# EAGLE design A4a ESP12 (EAGLE 9.6.2)
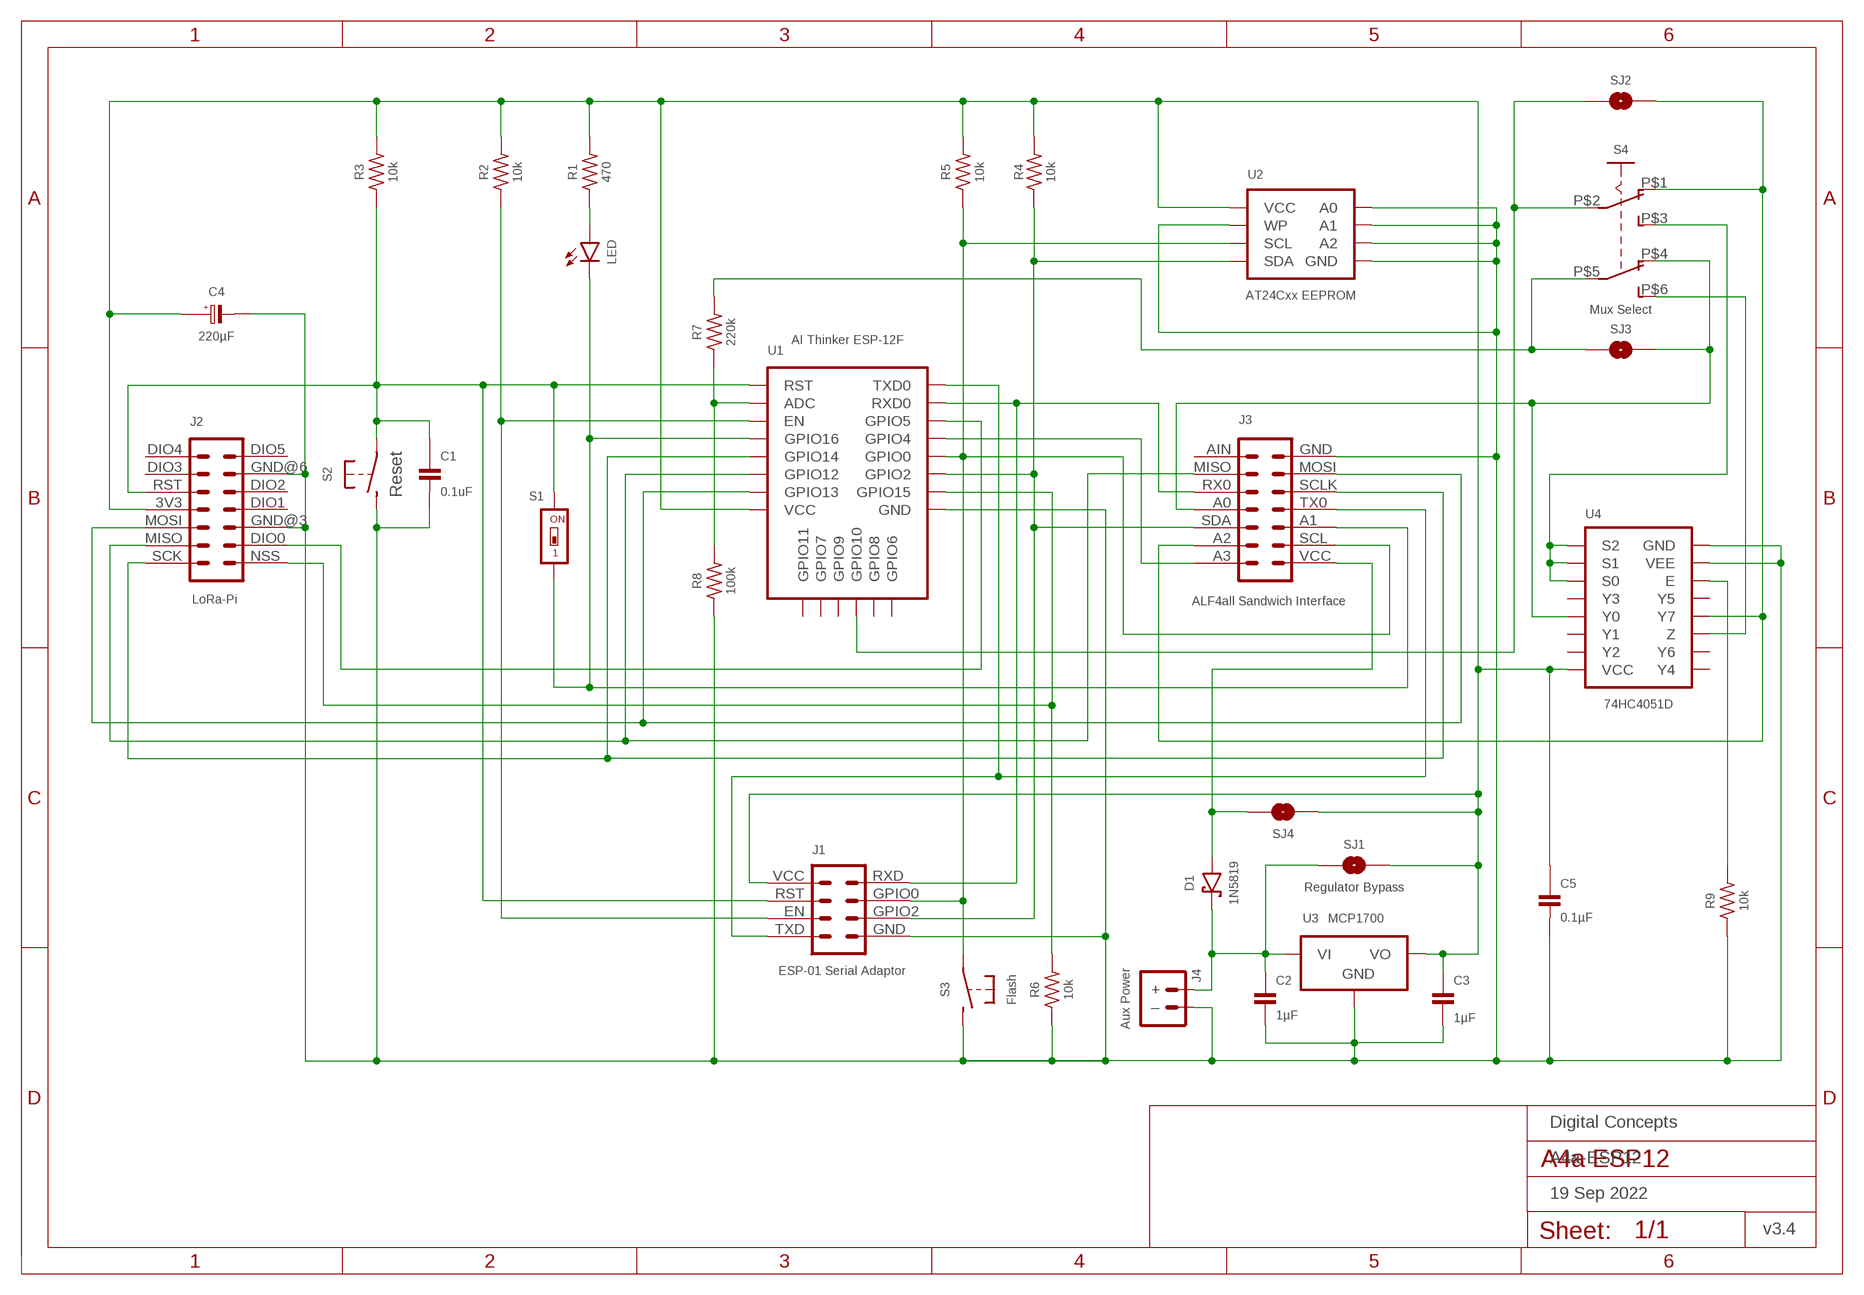
[diagram p0: schematic, sheet 1]
FRAME1 (A4L-LOC): DATE: 19 Sep 2022; OWNER: Digital Concepts; TITLE: A4a-ESP12; VERSION: v3.4

## Parts
C1  0.1uF  CAPACITOR-0805  [C0805]
C2  1µF  CAPACITOR  [C0805@1]
C3  1µF  CAPACITOR  [C0805@1]
C4  220µF  CAPACITOR-TANTALUM-3528  [C3528-21]
C5  0.1µF  CAPACITOR-0805  [C0805]
D1  1N5819  DIODE-SCHOTTKY-1N5819  [SOD-123]
J1  ESP-01 Serial Adaptor  ESP-01-SERIAL-ADAPTOR  [CONN_2X4-ESP-01-SERIAL]
J2  LoRa-Pi  RFM95W-PI-HEADER  [RFM95W-PI]
J3  ALF4all Sandwich Interface  HEADER-2X7-ALF4ALL-PROCESSOR-B  [CONN_2X7-ALF4ALL-PROCESSOR-B]
J4  Aux Power  JST-PH2.0-2-MALE-HORIZONTALJST-PTH-2  [JST-PH2.0-2-HORIZONTAL]
LED  LEDCHIP-LED0805  [CHIP-LED0805]
R1  470  RESISTORR0805  [R0805]
R2  10k  RESISTORR0805  [R0805]
R3  10k  RESISTORR0805  [R0805]
R4  10k  RESISTORR0805  [R0805]
R5  10k  RESISTORR0805  [R0805]
R6  10k  RESISTORR0805  [R0805]
R7  220k  RESISTORR0805  [R0805]
R8  100k  RESISTORR0805  [R0805]
R9  10k  RESISTORR0805  [R0805]
S1  Wake  SWITCH-DIP-SWS001  [SMD-001]
S2  Reset  SWITCH-MOMENTARY-2-PIN  [SWITCH-2-PAD]
S3  Flash  SWITCH-MOMENTARY-2-PIN  [SWITCH-2-PAD]
S4  Mux Select  SWITCH-SLIDE-DPDT  [SWITCH-DPDT-SMD]
SJ1  Regulator Bypass  SJ  [SJ]
SJ2  SJ  [SJ]
SJ3  SJ  [SJ]
SJ4  SJ  [SJ]
U1  AI Thinker ESP-12F  ESP-12E/F  [ESP-12E/F]
U2  AT24Cxx EEPROM  AT24CXX-EEPROM  [SOP-8]
U3  MCP1700  [SOT-23-3]
U4  74HC4051D  [SOP16]

## Nets
GND: C1.2 C2.2 C3.2 C4.2(-) C5.2 J1.GND J2.GND@3 J2.GND@6 J3.GND J4.-(–) R6.1 R8.1 R9.1 S2.P$2(S) S3.P$2(S) U1.GND U2.P$1(A0) U2.P$2(A1) U2.P$3(A2) U2.P$4(GND) U2.P$7(WP) U3.1(GND) U4.7(VEE) U4.8(GND)
N$1: S4.P$2(P1) SJ2.1 U1.GPIO10
N$2: J2.NSS R6.2 U1.GPIO15
N$3: J2.SCK J3.SCLK U1.GPIO14
N$4: C1.1 J1.RST J2.RST R3.1 S1.2 S2.P$1(P) U1.RST
N$5: J2.MISO J3.MISO U1.GPIO12
N$6: J2.MOSI J3.MOSI U1.GPIO13
N$7: R7.1 R8.2 U1.ADC
N$8: J1.EN R2.1 U1.EN
N$9: D1.A J3.VCC SJ4.1
N$10: J1.TXD J3.TX0 U1.TXD0
N$11: J1.GPIO2 J3.SDA R4.1 U1.GPIO2 U2.P$5(SDA)
N$12: J3.A3 U1.GPIO4
N$13: J1.GPIO0 J3.SCL R5.1 S3.P$1(P) U1.GPIO0 U2.P$6(SCL)
N$14: LED.A R1.1
N$15: J3.A1 LED.C S1.1 U1.GPIO16
N$16: J1.RXD J3.RX0 U1.RXD0
N$17: R9.2 U4.6(E)
N$19: J2.DIO0 U1.GPIO5
N$20: J3.A2 S4.P$1(O1) SJ2.2 U4.4(Y7)
N$21: J3.A0 S4.P$4(O2) SJ3.2 U4.13(Y0)
N$22: S4.P$6(S2) U4.3(Z)
N$23: S4.P$3(S1) U4.9(S2) U4.10(S1) U4.11(S0)
N$25: R7.2 S4.P$5(P2) SJ3.1
N$26: C2.1 D1.C J4.+ SJ1.1 U3.3(VI)
VCC: C3.1 C4.1(+) C5.1 J1.VCC J2.3V3 R1.2 R2.2 R3.2 R4.2 R5.2 SJ1.2 SJ4.2 U1.VCC U2.P$8(VCC) U3.2(VO) U4.16(VCC)
Unconnected: J2.DIO1 J2.DIO2 J2.DIO3 J2.DIO4 J2.DIO5 J3.AIN U1.CS0(GPIO11) U1.GPIO9 U1.MISO(GPIO7) U1.MOSI(GPIO8) U1.SCLK(GPIO6) U4.1(Y4) U4.2(Y6) U4.5(Y5) U4.12(Y3) U4.14(Y1) U4.15(Y2)

## Library data of the parts
C1 C5 = digitalconcepts:CAPACITOR-0805: 0805 Capacitor
C2 C3 = digitalconcepts:CAPACITOR: 0805 Capacitor
C4 = digitalconcepts:CAPACITOR-TANTALUM-3528: Capacitor Polarised EIA 3528-21 (KEMET B)
D1 = digitalconcepts:DIODE-SCHOTTKY-1N5819: 1N5819 Schottky Diode SOD-123
J1 = digitalconcepts:ESP-01-SERIAL-ADAPTOR: ESP-01 Serial Adpator
J2 = digitalconcepts:RFM95W-PI-HEADER: RFM95W LoRa Wireless Transceiver Raspberry Pi Daughter Board
J3 = digitalconcepts:HEADER-2X7-ALF4ALL-PROCESSOR-B: ALF4all 'Sandwich' Processor (Bottom) 2x7 Pin Header Header soldered to underside of PCB
J4 = digitalconcepts:JST-PH2.0-2-MALE-HORIZONTAL: PH2.0 2P Right Angle PCB Connector; PROD_ID: CONN-09863; SKU: PRT-09914
LED = digitalconcepts:LED: LED OSRAM: - CHIPLED LG R971, LG N971, LY N971, LG Q971, LY Q971, LO R971, LY R971 LH N974, LH R974 LS Q976, LO Q976, LY Q976 LO Q996 - Hyper CHIPLED LW Q18S LB Q993, LB Q99A, LB R99A - SideLED LS A670, LO A670, LY A670, LG A670, LP A670 LB A673, LV A673, LT A673, LW A673 LH A674 LY A675 LS A676, LA A676, LO A676, LY A676, LW A676 LS A679, LY A679, LG A679 - Hyper Micro SIDELED® LS Y876, LA Y876, LO Y876, LY Y876 LT Y87S - SmartLED LW L88C, LW L88S LB L89C, LB L89S, LG L890 LS L89K, LO L89K, LY L89K LS L896, LA L896, LO L896, LY L896 - TOPLED LS T670, LO T670, LY T670, LG T670, LP T670 LSG T670, LSP T670, LSY T670, LOP T670, LYG T670 LG T671, LOG T671, LSG T671 LB T673, LV T673, LT T673, LW T673 LH T674 LS T676, LA T676, LO T676, LY T676, LB T676, LH T676, LSB T676, LW T676 LB T67C, LV T67C, LT T67C, LS T67K, LO T67K, LY T67K, LW E67C LS E67B, LA E67B, LO E67B, LY E67B, LB E67C, LV E67C, LT E67C LW T67C LS T679, LY T679, LG T679 LS T770, LO T770, LY T770, LG T770, LP T770 LB T773, LV T773, LT T773, LW T773 LH T774 LS E675, LA E675, LY E675, LS T675 LS T776, LA T776, LO T776, LY T776, LB T776 LHGB T686 LT T68C, LB T68C - Hyper Mini TOPLED® LB M676 - Mini TOPLED Santana® LG M470 LS M47K, LO M47K, LY M47K Source: http://www.osram.convergy.de LUXEON: - LUMILED® LXK2-PW12-R00, LXK2-PW12-S00, LXK2-PW14-U00, LXK2-PW14-V00 LXK2-PM12-R00, LXK2-PM12-S00, LXK2-PM14-U00 LXK2-PE12-Q00, LXK2-PE12-R00, LXK2-PE12-S00, LXK2-PE14-T00, LXK2-PE14-U00 LXK2-PB12-K00, LXK2-PB12-L00, LXK2-PB12-M00, LXK2-PB14-N00, LXK2-PB14-P00, LXK2-PB14-Q00 LXK2-PR12-L00, LXK2-PR12-M00, LXK2-PR14-Q00, LXK2-PR14-R00 LXK2-PD12-Q00, LXK2-PD12-R00, LXK2-PD12-S00 LXK2-PH12-R00, LXK2-PH12-S00 LXK2-PL12-P00, LXK2-PL12-Q00, LXK2-PL12-R00 Source: www.luxeon.com KINGBRIGHT: KA-3528ASYC Source: www.kingbright.com
R1-R9 = digitalconcepts:RESISTOR: Resistor; SPICEPREFIX: R
S1 = digitalconcepts:SWITCH-DIP-SWS001: SMD Dip Switch 1 pol.
S2 S3 = digitalconcepts:SWITCH-MOMENTARY-2-PIN: 2 Pin Momentary Switch
S4 = digitalconcepts:SWITCH-SLIDE-DPDT: Switch SMD DPDT
SJ1-SJ4 = digitalconcepts:SJ: Solder Jumper
U1 = digitalconcepts:ESP-12E/F: AI Thinker ESP-12E/F MCU
U2 = digitalconcepts:AT24CXX-EEPROM: AT24Cxx EEPROM SOP-8
U3 = digitalconcepts:MCP1700: MCP1700 Low Quiescent Current LDO Voltage Regulator
U4 = digitalconcepts:74HC4051D: 74HC4051 8-Port Multiplexer SOP-16

## Board
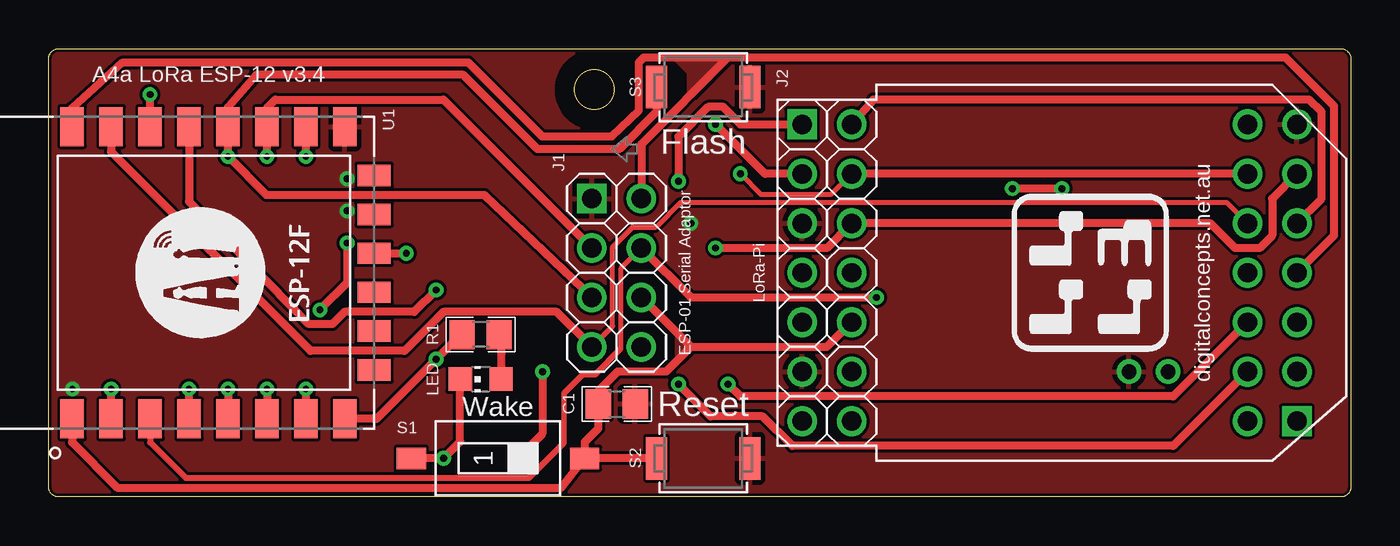
[diagram p1: board, top side]
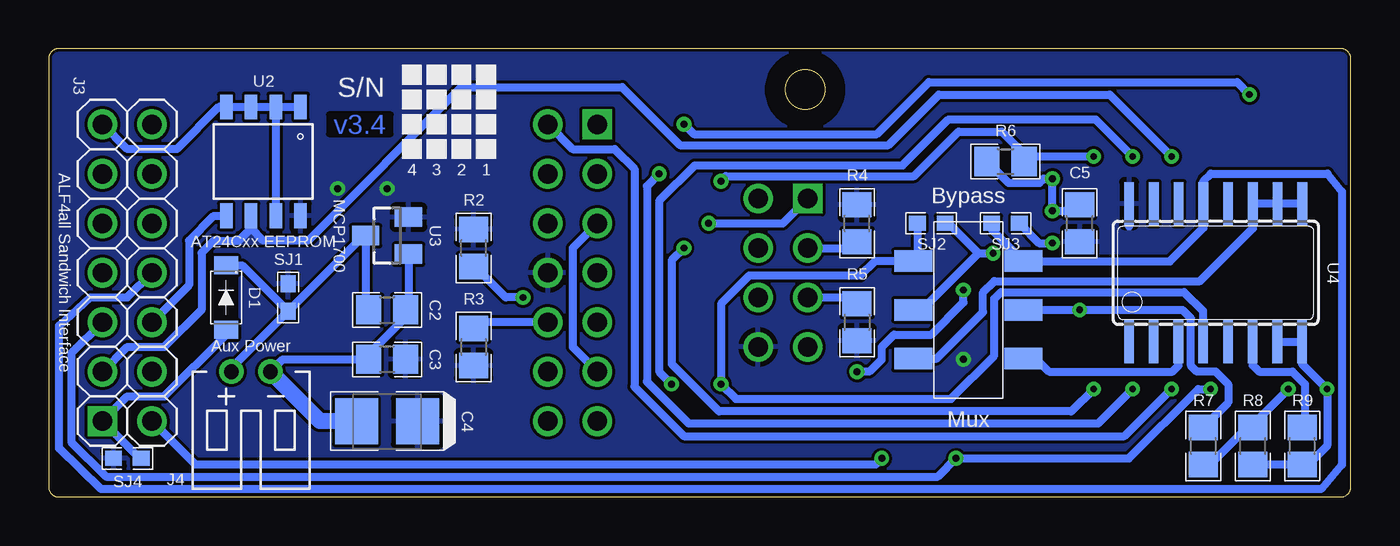
[diagram p2: board, bottom side, seen from below]

Size 66.85 x 23 mm. Coordinates in mm from the lower left corner, seen from the top.
Outline: 66.39,23 66.42,23 66.45,22.99 66.49,22.98 66.52,22.97 66.55,22.96 66.58,22.95 66.61,22.93 66.63,22.91 66.66,22.9 66.68,22.88 66.71,22.85 66.73,22.83 66.75,22.81 66.77,22.78 66.78,22.75 66.8,22.72 66.81,22.69 66.83,22.66 66.84,22.63 66.84,22.6 66.85,22.57 66.85,22.53 66.85,0.47 66.85,0.43 66.84,0.4 66.84,0.37 66.83,0.34 66.81,0.31 66.8,0.28 66.78,0.25 66.77,0.22 66.75,0.19 66.73,0.17 66.68,0.12 66.66,0.1 66.63,0.09 66.61,0.07 66.58,0.05 66.55,0.04 66.52,0.03 66.49,0.02 66.45,0.01 66.42,0 66.39,0 0.47,0 0.43,0 0.4,0.01 0.37,0.02 0.34,0.03 0.28,0.05 0.25,0.07 0.22,0.09 0.19,0.1 0.17,0.12 0.12,0.17 0.1,0.19 0.09,0.22 0.07,0.25 0.05,0.28 0.04,0.31 0.03,0.34 0.02,0.37 0.01,0.4 0,0.43 0,0.47 0,22.53 0,22.57 0.01,22.6 0.02,22.63 0.03,22.66 0.04,22.69 0.05,22.72 0.07,22.75 0.09,22.78 0.1,22.81 0.12,22.83 0.15,22.85 0.17,22.88 0.19,22.9 0.22,22.91 0.25,22.93 0.28,22.95 0.34,22.97 0.37,22.98 0.4,22.99 0.43,23 0.47,23 66.39,23
Outline: circle at 28.02,20.9 radius 1.02
Copper layers (1*16): Top 0.035mm / dielectric 1.5mm / Bottom 0.035mm
Design rules "default *": minimum track width 6mil, minimum drill 0.35mm, track to track 6mil, track to pad 6mil, pad to pad 6mil, via to via 6mil, smd to smd 6mil, copper to edge 6mil, drill to drill 6mil, minimum pad ring 10mil, minimum via ring 8mil, stop-mask expansion 4mil, vias tented up to drill 0mil, thermal gap 10mil

### Footprints (pad centres in the part's own frame; a part is rotated, then mirrored left to right if it is on the bottom)
C0805 = smd 1.3 x 1.5: 1 -0.95,0; 2 0.95,0
C0805@1 = smd 1.3 x 1.5: 1 -0.95,0; 2 0.95,0
C3528-21 = smd 2.21 x 2.35: 1 -1.565,0; 2 1.565,0
SOD-123 = smd 0.91 x 1.22: A -1.65,0; C 1.65,0
CONN_2X4-ESP-01-SERIAL = drill 1 pad 1.524: EN 2.54,2.54; GPIO0 5.08,0; GPIO2 2.54,0; RST 5.08,2.54; RXD 7.62,0; TXD 0,2.54; VCC 7.62,2.54 | drill 1 pad 1.524 square: GND 0,0
RFM95W-PI = drill 1 pad 1.524: 3V3 7.62,2.54; DIO0 2.54,0; DIO1 7.62,0; DIO2 10.16,0; DIO3 12.7,2.54; DIO4 15.24,2.54; DIO5 15.24,0; GND@3 5.08,0; GND@6 12.7,0; MISO 2.54,2.54; MOSI 5.08,2.54; RST 10.16,2.54; SCK 0,2.54 | drill 1 pad 1.524 square: NSS 0,0
CONN_2X7-ALF4ALL-PROCESSOR-B = drill 1 pad 1.524: A0 7.62,2.54; A1 5.08,0; A2 2.54,2.54; A3 0,2.54; AIN 15.24,2.54; GND 15.24,0; MISO 12.7,2.54; MOSI 12.7,0; RX0 10.16,2.54; SCL 2.54,0; SCLK 10.16,0; SDA 5.08,2.54; TX0 7.62,0 | drill 1 pad 1.524 square: VCC 0,0
JST-PH2.0-2-HORIZONTAL = drill 0.75: + 1,0; - -1,0
CHIP-LED0805 = smd 1.2 x 1.2: A 0,-1.05; C 0,1.05
R0805 = smd 1.3 x 1.5: 1 -0.95,0; 2 0.95,0
SMD-001 = smd 1.1 x 1.5: 1 0,-4.45; 2 0,4.45
SWITCH-2-PAD = smd 1.067 x 2.184: P$1 -2.4,0; P$2 2.4,0
SWITCH-DPDT-SMD = smd 1.95 x 1.1: P$1 -2.825,2.5; P$2 -2.825,0; P$3 -2.825,-2.5; P$4 2.825,2.5; P$5 2.825,0; P$6 2.825,-2.5
SJ = smd 0.864 x 0.762: 1 -0.711,0; 2 0.711,0
ESP-12E/F = smd 2 x 1.2: ADC -7.5,5; EN -7.5,3; GND 7.5,-7; GPIO0 7.5,-1; GPIO2 7.5,-3; GPIO4 7.5,1; GPIO5 7.5,3; GPIO12 -7.5,-3; GPIO13 -7.5,-5; GPIO14 -7.5,-1; GPIO15 7.5,-5; GPIO16 -7.5,1; RST -7.5,7; RXD0 7.5,5; TXD0 7.5,7; VCC -7.5,-7 | smd 1.1 x 1.7: CS0 -5,-8.5; GPIO9 -1,-8.5; GPIO10 1,-8.5; MISO -3,-8.5; MOSI 3,-8.5; SCLK 5,-8.5
SOP-8 = smd 0.635 x 1.27: P$1 -1.905,-2.794; P$2 -0.635,-2.794; P$3 0.635,-2.794; P$4 1.905,-2.794; P$5 1.905,2.794; P$6 0.635,2.794; P$7 -0.635,2.794; P$8 -1.905,2.794
SOT-23-3 = smd 1 x 1.4: 1 -0.95,-1.1; 2 0.95,-1.1; 3 0,1.1
SOP16 = smd 0.5 x 2.2: 1 -4.445,-3.55; 2 -3.185,-3.55; 3 -1.915,-3.55; 4 -0.645,-3.55; 5 0.635,-3.55; 6 1.895,-3.55; 7 3.165,-3.55; 8 4.435,-3.55; 9 4.445,3.55; 10 3.175,3.55; 11 1.905,3.55; 12 0.635,3.55; 13 -0.635,3.55; 14 -1.905,3.55; 15 -3.175,3.55; 16 -4.445,3.55

### Placement (x,y rotation side)
C1  29.16,4.77 0 top
C2  49.48,9.6 0 bottom
C3  49.48,7.06 180 bottom
C4  49.48,3.88 180 bottom
C5  13.92,14.04 90 bottom
D1  57.73,10.23 90 bottom
J1  27.89,15.31 270 top
J2  38.68,19.12 270 top
J3  64.08,3.88 90 top
J4  56.46,6.42 180 bottom
LED  22.17,6.04 90 top
R1  22.17,8.33 180 top
R2  45.03,12.77 90 bottom
R3  45.03,7.69 270 bottom
R4  25.35,14.04 90 bottom
R5  25.35,8.96 270 bottom
R6  17.73,17.22 0 bottom
R7  7.57,2.61 90 bottom
R8  5.03,2.61 90 bottom
R9  2.49,2.61 90 bottom
S1  23.06,1.98 270 top
S2  33.6,1.98 0 top
S3  33.6,21.03 0 top
S4  19.63,9.6 0 bottom
SJ1  54.56,10.23 90 bottom
SJ2  21.54,14.04 180 bottom
SJ3  17.73,14.04 180 bottom
SJ4  62.81,1.98 180 bottom
U1  8.2,11.5 90 top
U2  55.83,17.22 180 bottom
U3  49.48,13.41 90 bottom
U4  6.93,11.5 0 bottom

### Tracks (layer width: path | path; a pad name or v marks a point on that pad's centre or on a via)
$X1
  cutout Top: 28.02,22.93 arc180 28.02,18.87 arc180
$X2
  cutout Bottom: 28.02,22.93 arc180 28.02,18.87 arc180
GND  (via drill 0.35)
  Bottom 0.406: U2.P$2 U2.P$3 U2.P$4 58.12,20.01 60.27,17.85 62.81,17.85 J3.GND | U2.P$2 U2.P$1 | U2.P$2 U2.P$7 | J4.- 54.83,7.06 C3.2 50.43,7.32 48.53,9.22 C2.2 48.38,9.6 U3.1 | U4.7 U4.8 2.5,6.81 v1.22,5.53 1.22,2.61 2.17,1.66 R9.1 R8.1 | J2.GND@3 39.95,12.77 39.95,7.69 J2.GND@6 | v32.97,14.04 29.16,14.04 J1.GND | R6.1 17.79,16.32 17.58,16.11 15.98,16.11 15.77,16.33 v15.32,16.33 v15.32,14.68 14.23,14.68 C5.2
  Bottom 0.813: J4.- 52.92,3.88 C4.2
  pour Top (rank 3): -1.32,24.2 67.89,24.2 67.89,-1.2 -1.32,-1.2
N$1  (via drill 0.35)
  Top 0.406: U1.GPIO10 v18.36,12.5
  Bottom 0.406: S4.P$2 22.03,9.6 19.13,12.5 | 19.13,12.5 v18.36,12.5 | 19.13,12.5 20.67,14.04 SJ2.1
N$2  (via drill 0.35)
  Top 0.406: v32.33,16.2 32.33,18.49 33.86,20.01 34.62,20.01 35.51,19.12 J2.NSS | U1.GPIO15 v13.2,17.47
  Bottom 0.406: v32.33,16.2 32.08,16.45 22.43,16.45 20.14,18.74 17.92,18.74 16.78,17.6 R6.2 16.53,17.47 v13.2,17.47
N$3  (via drill 0.35)
  Top 0.406: J3.SCLK 65.35,15.31 65.35,19.76 64.72,20.39 42.34,20.39 J2.SCK | v9.2,5.53 U1.GPIO14
  Bottom 0.406: J2.SCK 39.95,17.85 37.8,17.85 36.78,16.84 36.78,5.66 34.24,3.12 11.62,3.12 v9.2,5.53
N$4
  Top 0.406: U1.RST 1.2,2.8 3.55,0.45 26.29,0.45 S1.2 | 32.97,7.69 39.95,7.69 J2.RST | 32.97,7.69 31.7,6.42 29.21,6.42 28.21,5.42 C1.1 28.21,3.5 27.51,2.8 S1.2 | J1.RST 32.97,7.69 | S2.P$1 S1.2
  Bottom 0.406: J2.RST 44.87,8.96 R3.1
  pour Top: 32.97,7.69 32.33,8.33 32.33,7.06
N$5  (via drill 0.35)
  Top 0.254: v35.51,16.58 36.58,15.51 40.16,15.51 J2.MISO
  Top 0.406: J3.MISO J2.MISO | v11.2,5.53 U1.GPIO12
  Bottom 0.406: v35.51,16.58 36.14,15.95 36.14,5.91 33.99,3.75 12.98,3.75 v11.2,5.53
N$6  (via drill 0.35)
  Top 0.406: J3.MOSI 62.81,15.31 62.81,13.41 62.18,12.77 60.91,12.77 59.64,14.04 J2.MOSI 39.95,12.77 v34.24,12.77 | v13.2,5.53 U1.GPIO13
  Bottom 0.406: v34.24,12.77 34.87,12.14 34.87,6.83 32.44,4.39 14.35,4.39 v13.2,5.53
N$7  (via drill 0.35)
  Top 0.406: U1.ADC v3.2,5.53
  Bottom 0.406: R7.1 7.21,1.66 5.31,3.56 R8.2 5.03,3.71 v3.2,5.53
N$8  (via drill 0.35)
  Top 0.254: J1.EN 29.36,11.7 29.36,7.59
  Top 0.279: 29.36,7.59 28.04,6.27 27.41,6.27 26.45,5.32 26.45,2.78 24.64,0.96
  Top 0.305: 24.64,0.96 7.05,0.96 5.21,2.8 U1.EN
  Top 0.406: J1.EN 32.97,10.23 v42.49,10.23
  Bottom 0.406: v42.49,10.23 43.38,10.23 44.97,11.82 R2.1
N$9
  Bottom 0.406: D1.A 57.73,8.33 60.91,5.15 62.81,5.15 J3.VCC 62.18,1.98 SJ4.1
N$10
  Top 0.406: J3.TX0 65.99,13.41 65.99,20.06 63.5,22.55 34.87,22.55 | U1.TXD0 1.2,19.95 3.81,22.3 21.54,22.3 25.35,18.49 28.91,18.49 30.3,19.82 30.3,22.3 30.56,22.55 34.87,22.55 | 34.87,22.55 30.43,18.11 J1.TXD
  pour Top: 34.87,22.55 32.97,20.65 32.97,21.79 32.21,22.55
N$11  (via drill 0.35)
  Top 0.406: J3.SDA 57.73,5.15 35.51,5.15 v34.87,5.79 | J1.GPIO2 20.27,20.39 11.63,20.39 11.2,19.96 U1.GPIO2 v11.2,17.47
  Bottom 0.406: v34.87,5.79 35.51,6.42 35.51,15.18 33.68,17.01 23.01,17.01 20.65,19.38 13.11,19.38 v11.2,17.47 | J3.SDA 59.64,10.87 59.64,13.15 58.37,14.42 U2.P$5 | R4.1 25.67,12.77 J1.GPIO2
N$12  (via drill 0.35)
  Top 0.406: U1.GPIO4 7.2,15.15 13.35,8.86 14.55,8.86 15.19,9.49 18.77,9.49 v19.89,10.61 | v25.35,6.42 25.35,3.25 v24.08,1.98
  Bottom 0.406: J3.A3 59.33,1.67 24.38,1.67 v24.08,1.98 | v25.35,6.42 24.71,6.42 24.08,7.06 24.08,7.69 23.44,8.33 21.54,8.33 19.89,9.98 v19.89,10.61
N$13  (via drill 0.35)
  Top 0.406: J1.GPIO0 22.38,15.49 11.19,15.49 v9.2,17.47 U1.GPIO0 9.2,20.02 10.65,21.66 21.29,21.66 25.1,17.85 29.3,17.85 31.2,19.76 S3.P$1
  Bottom 0.406: J3.SCL 62.81,7.69 60.91,7.69 59,9.6 59,12.52 58.37,13.15 57.1,13.15 56.46,13.79 | U2.P$6 56.46,13.79 | v9.2,17.47 12.38,20.65 21.16,20.65 23.75,18.05 34.44,18.05 37.41,21.03 45.67,21.03 53.54,13.15 55.83,13.15 56.46,13.79 | J1.GPIO0 25.67,10.23 R5.1
  pour Bottom: 56.46,13.79 57.1,13.15 55.83,13.15
N$14
  Top 0.406: R1.1 23.22,8.23 LED.A
N$15  (via drill 0.35)
  Top 0.406: U1.GPIO16 v7.2,5.53 | S1.1 v20.27,1.98 21.12,2.83 LED.C
  Bottom 0.406: v7.2,5.53 7.84,5.53 11.4,1.98 v20.27,1.98 21.21,1.04 63.91,1.04 65.68,2.81 65.68,7.36 J3.A1
N$16
  Top 0.254: J3.RX0 60.48,15.11 32.45,15.11 31.18,13.84 29.97,13.84 28.96,12.82 28.96,8.76 J1.RXD
  Top 0.406: J1.RXD 26.09,9.49 20.27,9.49 18.26,7.49 13.44,7.49 3.2,17.72 U1.RXD0
N$17
  Bottom 0.406: R9.2 2.36,3.69 2.36,5.79 3,6.42 4.71,6.42 5.04,6.75 U4.6
N$19  (via drill 0.35)
  Top 0.406: J2.DIO0 36.78,16.58 v34.24,19.12 | U1.GPIO5 v5.2,20.65
  Bottom 0.406: v5.2,20.65 5.84,21.28 21.67,21.28 24.33,18.61 33.73,18.61 v34.24,19.12
N$20  (via drill 0.35)
  Top 0.406: v32.33,5.79 33.99,4.14 36.65,4.14 38.18,2.61 57.73,2.61 J3.A2
  Bottom 0.406: U4.4 7.58,9.53 8.56,10.51 17.96,10.51 18.3,10.17 18.3,7.25 20.52,5.02 31.57,5.02 v32.33,5.79 32.33,9.91 30.89,11.35 25.19,11.35 24.44,12.1 S4.P$1 22.25,12.31 SJ2.2
N$21
  Bottom 0.406: J3.A0 62.81,10.23 64.72,10.23 66.32,8.78 66.32,2.48 64.16,0.4 1.52,0.4 0.46,1.64 0.46,15.66 1.21,16.59 7.19,16.59 7.57,16.21 U4.13 7.57,13.81 9.29,12.09 14.82,12.09 14.83,12.1 S4.P$4 18.44,13.73 SJ3.2
N$22
  Bottom 0.406: S4.P$6 16.17,7.1 15.5,6.42 9.16,6.42 8.85,6.73 U4.3
N$23
  Bottom 0.406: U4.9 U4.10 U4.11 5.03,13.78 7.74,11.07 18.31,11.07 18.88,10.5 18.88,9.48 21.27,7.1 S4.P$3
N$25  (via drill 0.35)
  Top 0.406: v15.32,13.03 15.32,10.99 v13.92,9.6
  Bottom 0.406: R7.2 6.3,4.83 6.3,5.79 6.93,6.42 7.9,6.42 8.2,6.72 8.2,9.16 8.64,9.6 v13.92,9.6 S4.P$5 | SJ3.1 16,13.03 v15.32,13.03
N$26
  Bottom 0.406: C2.1 50.58,9.75 U3.3 50.67,13.41 SJ1.1 | J4.+ 57.46,6.62 SJ1.1 | D1.C 56.92,11.88 SJ1.1
VCC  (via drill 0.35)
  Top 0.406: U1.VCC 16.83,4 v19.89,7.06 21.16,8.33 R1.2 | v52.02,15.82 v49.48,15.82
  Bottom 0.406: U4.16 11.38,13.88
  pour Bottom (rank 3): -0.69,23.57 67.26,23.57 67.26,-0.56 -0.69,-0.56

### Text on the board
Bottom: v3.4
tPlace: A4a LoRa ESP-12 v3.4 | digitalconcepts.net.au
bPlace: S/N | 1 | 2 | 3 | 4
bNames: Bypass | Mux